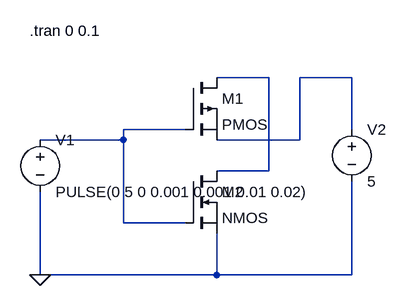
[diagram p0: schematic Draft15.asc]
Draft15.asc, the LTspice schematic file:
Version 4
SHEET 1 880 680
WIRE 672 80 592 80
WIRE 800 80 720 80
WIRE 544 160 448 160
WIRE 800 160 800 80
WIRE 448 176 448 160
WIRE 448 176 320 176
WIRE 720 176 720 80
WIRE 720 176 592 176
WIRE 672 224 672 80
WIRE 672 224 592 224
WIRE 448 304 448 176
WIRE 544 304 448 304
WIRE 320 384 320 256
WIRE 592 384 592 320
WIRE 592 384 320 384
WIRE 800 384 800 240
WIRE 800 384 592 384
FLAG 320 384 0
SYMBOL voltage 320 160 R0
SYMATTR InstName V1
SYMATTR Value PULSE(0 5 0 0.001 0.001 0.01 0.02)
SYMBOL pmos 544 80 R0
SYMATTR InstName M1
SYMBOL nmos 544 224 R0
SYMATTR InstName M2
SYMBOL voltage 800 144 R0
SYMATTR InstName V2
SYMATTR Value 5
TEXT 304 8 Left 2 !.tran 0 0.1

The netlist it stands for:
* Draft15.asc
V1 N003 0 PULSE(0 5 0 0.001 0.001 0.01 0.02)
M1 N001 N003 N002 N002 PMOS
M2 N001 N003 0 0 NMOS
V2 N002 0 5
.model NMOS NMOS
.model PMOS PMOS
.lib standard.mos
.tran 0 0.1
.backanno
.end